# Altium project DisplayBoard.PrjPcb
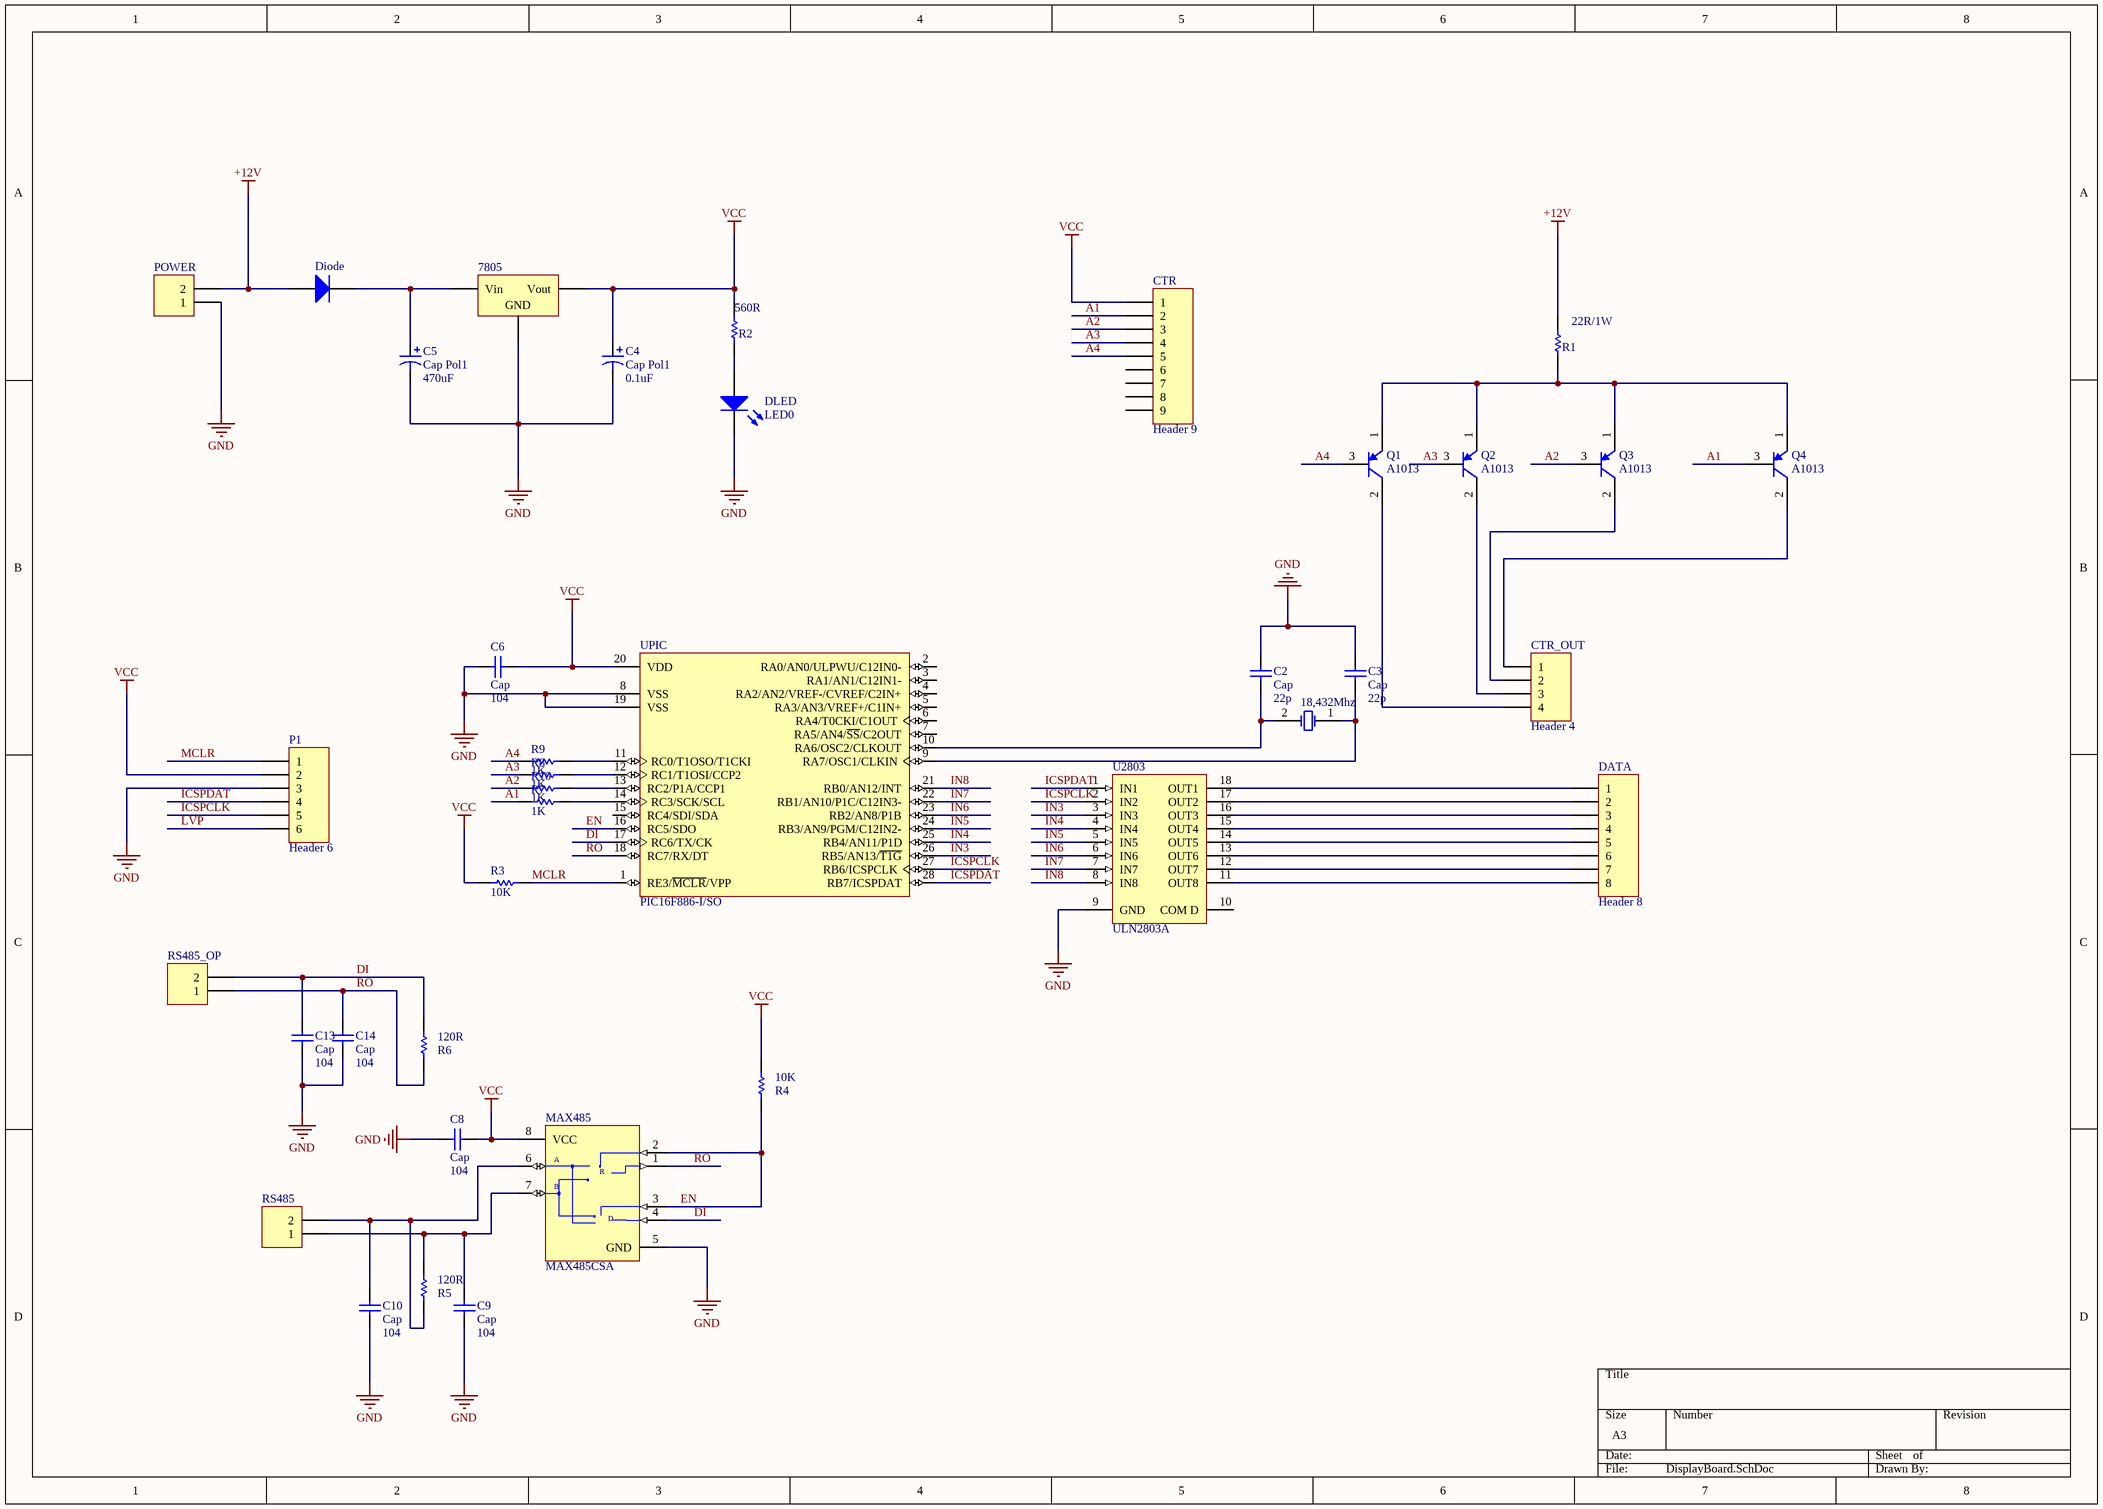
[diagram p0: DisplayBoard.SchDoc]
1 sheet, 38 parts. Net scope: global (net labels, ports and power ports of the same name join across sheets).
Board file: DisplayBoard.PcbDoc

## Sheet DisplayBoard.SchDoc
size A3

### Parts
18,432Mhz  XTAL  [Xtal12M]  (value not drawn)
7805  Volt Reg  [78xx_NO]  (value not drawn)
C2  Cap  value 22p  [tu_gom]
C3  Cap  value 22p  [tu_gom]
C4  Cap Pol1  value 0.1uF  [tu 100uF/50v]
C5  Cap Pol1  value 470uF  [TU 470uF/50V]
C6  Cap  value 104  [tu_gom]
C8  Cap  value 104  [tu_gom]
C9  Cap  value 104  [tu_gom]
C10  Cap  value 104  [tu_gom]
C13  Cap  value 104  [tu_gom]
C14  Cap  value 104  [tu_gom]
CTR  Header 9  [HDR1X9]
CTR_OUT  Header 4  [CAP 4]
DATA  Header 8  [Cap_8]
Diode  Diode  [D_2A]  (value not drawn)
DLED  LED0  [LED_3]
MAX485  MAX485CSA  [NSO8_N]
P1  Header 6  [HDR1X6]
POWER  Header 2  [Header2 - duplicate]  (value not drawn)
Q1  A1013  [A1013]
Q2  A1013  [A1013]
Q3  A1013  [A1013]
Q4  A1013  [A1013]
R1  22R/1W  [R_CS220/470/1W]
R2  560R  [R_Nor]
R3  10K  [R_Nor]
R4  10K  [R_Nor]
R5  120R  [R_Nor]
R6  120R  [R_Nor]
R7  1K  [R_Nor]
R8  1K  [R_Nor]
R9  1K  [R_Nor]
R10  1K  [R_Nor]
RS485  Header 2  [Header2 - duplicate]  (value not drawn)
RS485_OP  Header 2  [Header2 - duplicate]  (value not drawn)
U2803  ULN2803A  [DIP18]
UPIC  PIC16F886-I/SO  [SOIC-SO28_L]

### Nets
+12V: Diode.1(A) POWER.2 R1.2
GND: 7805.2(GND) C2.2 C3.2 C4.2 C5.2 C6.2 C8.1 C9.1 C10.1 C13.1 C14.1 DLED.2(K) MAX485.5(GND) P1.3 POWER.1 U2803.9(GND) UPIC.8(VSS) UPIC.19(VSS)
VCC: 7805.3(Vout) C4.1 C6.1 C8.2 CTR.1 MAX485.8(VCC) P1.2 R2.2 R3.2 R4.2 UPIC.20(VDD)
A1: CTR.2 Q4.3(B) R7.2
A2: CTR.3 Q3.3(B) R10.2
A3: CTR.4 Q2.3(B) R8.2
A4: CTR.5 Q1.3(B) R9.2
DI: C13.2 MAX485.4(DI) R6.2 RS485_OP.2 UPIC.17(RC6/TX/CK)
EN: MAX485.2(~{RE}) MAX485.3(DE) R4.1 UPIC.16(RC5/SDO)
ICSPCLK: P1.5 U2803.2(IN2) UPIC.27(RB6/ICSPCLK)
ICSPDAT: P1.4 U2803.1(IN1) UPIC.28(RB7/ICSPDAT)
IN3: U2803.3(IN3) UPIC.26(RB5/AN13/~{T1G})
IN4: U2803.4(IN4) UPIC.25(RB4/AN11/P1D)
IN5: U2803.5(IN5) UPIC.24(RB3/AN9/PGM/C12IN2-)
IN6: U2803.6(IN6) UPIC.23(RB2/AN8/P1B)
IN7: U2803.7(IN7) UPIC.22(RB1/AN10/P1C/C12IN3-)
IN8: U2803.8(IN8) UPIC.21(RB0/AN12/INT)
LVP: P1.6
MCLR: P1.1 R3.1 UPIC.1(RE3/~{MCLR}/VPP)
RO: C14.2 MAX485.1(RO) R6.1 RS485_OP.1 UPIC.18(RC7/RX/DT)
Net18,432Mhz_1: 18,432Mhz.1(OSC1) C3.1 UPIC.9(RA7/OSC1/CLKIN)
Net18,432Mhz_2: 18,432Mhz.2(OSC2) C2.1 UPIC.10(RA6/OSC2/CLKOUT)
Net7805_1: 7805.1(Vin) C5.1 Diode.2(K)
NetC9_2: C9.2 MAX485.7(B) R5.2 RS485.1
NetC10_2: C10.2 MAX485.6(A) R5.1 RS485.2
NetCTR_OUT_1: CTR_OUT.1 Q4.2(C)
NetCTR_OUT_2: CTR_OUT.2 Q3.2(C)
NetCTR_OUT_3: CTR_OUT.3 Q2.2(C)
NetCTR_OUT_4: CTR_OUT.4 Q1.2(C)
NetDATA_1: DATA.1 U2803.18(OUT1)
NetDATA_2: DATA.2 U2803.17(OUT2)
NetDATA_3: DATA.3 U2803.16(OUT3)
NetDATA_4: DATA.4 U2803.15(OUT4)
NetDATA_5: DATA.5 U2803.14(OUT5)
NetDATA_6: DATA.6 U2803.13(OUT6)
NetDATA_7: DATA.7 U2803.12(OUT7)
NetDATA_8: DATA.8 U2803.11(OUT8)
NetDLED_1: DLED.1(A) R2.1
NetQ1_1: Q1.1(E) Q2.1(E) Q3.1(E) Q4.1(E) R1.1
NetR7_1: R7.1 UPIC.14(RC3/SCK/SCL)
NetR8_1: R8.1 UPIC.12(RC1/T1OSI/CCP2)
NetR9_1: R9.1 UPIC.11(RC0/T1OSO/T1CKI)
NetR10_1: R10.1 UPIC.13(RC2/P1A/CCP1)

Not connected (* = marked no-connect by the designer): CTR 6 7 8 9; U2803 10(COM_D); UPIC 2(RA0/AN0/ULPWU/C12IN0-) 3(RA1/AN1/C12IN1-) 4(RA2/AN2/VREF-/CVREF/C2IN+) 5(RA3/AN3/VREF+/C1IN+) 6(RA4/T0CKI/C1OUT) 7(RA5/AN4/~{SS}/C2OUT) 15(RC4/SDI/SDA)

### Notes on the sheet
- (in symbol MAX485CSA) R; D

### Library data of the parts
18,432Mhz = XTAL: Crystal Oscillator; Published: 8-Jun-2000; LatestRevisionDate: 17-Jul-2002; LatestRevisionNote: Re-released for DXP Platform.; PackageReference: R38; Publisher: Altium Limited
7805 = Volt Reg: Voltage Regulator; Published: 24-Mar-1999; LatestRevisionDate: 29-May-2009; LatestRevisionNote: IPC-7351 Footprint Added.; PackageReference: D2PAK; Publisher: Altium Limited; PackageDescription: 3-Pin Transistor Outline Package 2.54 mm Pitch, 15.1 mm Lead Span
C2 C3 C6 C8-C10 C13 C14 = Ceramic: Capcitor
C4 C5 = Cap Pol1: Polarized Capacitor (Radial); Published: 8-Jun-2000; LatestRevisionDate: 17-Jul-2002; LatestRevisionNote: Re-released for DXP Platform.; PackageReference: RB7.6-15; Publisher: Altium Limited
CTR = Header 9: Header, 9-Pin; LatestRevisionDate: 17-Jul-2002; LatestRevisionNote: Re-released for DXP Platform.; Publisher: Altium Limited
CTR_OUT = Header 4: Header, 4-Pin; LatestRevisionDate: 17-Jul-2002; LatestRevisionNote: Re-released for DXP Platform.; Publisher: Altium Limited
DATA = Header 8: Header, 8-Pin; LatestRevisionDate: 17-Jul-2002; LatestRevisionNote: Re-released for DXP Platform.; Publisher: Altium Limited
Diode = Diode: Default Diode; Published: 8-Jun-2000; LatestRevisionDate: 17-Jul-2002; LatestRevisionNote: Re-released for DXP Platform.; PackageVersion: Sep-1996; PackageReference: SMC; Publisher: Altium Limited; Code_JEDEC: DO-214-AB
DLED = LED0: Typical INFRARED GaAs LED; Published: 8-Jun-2000; LatestRevisionDate: 08-Jul-2005; LatestRevisionNote: Mech Layer 1 removed.; PackageReference: LED-0; Publisher: Altium Limited
MAX485 = MAX485CSA: Low-Power, Slew-Rate-Limited RS-485/RS-422 Transceiver; Published: 16-Jan-2001; LatestRevisionDate: 13-Apr-2006; LatestRevisionNote: IPC-7351 Footprint Added.; DatasheetVersion: Feb-1996; PackageReference: NSO8; Publisher: Altium Limited; PackageDescription: 8-Pin Small Outline Integrated Circuit 1.27 mm Pitch; Code_JEDEC: MS-012-AA; Code_IPC: SOIC127P600-8; ComponentLink1Description: Manufacturer Link; ComponentLink1URL: http://www.maxim-ic.com/; ComponentLink2Description: Datasheet; ComponentLink2URL: http://pdfserv.maxim-ic.com/en/ds/MAX1487-MAX491.pdf
P1 = Header 6: Header, 6-Pin; LatestRevisionDate: 17-Jul-2002; LatestRevisionNote: Re-released for DXP Platform.; Publisher: Altium Limited
POWER RS485 RS485_OP = Header 2: Header, 2-Pin; LatestRevisionDate: 17-Jul-2002; LatestRevisionNote: Re-released for DXP Platform.; Publisher: Altium Limited
Q1-Q4 = PNP: PNP Bipolar Transistor; Published: 8-Jun-2000; LatestRevisionDate: 29-May-2009; LatestRevisionNote: IPC-7351 Footprint Added.; PackageVersion: Aug-1999; PackageReference: SOT-23B; Publisher: Altium Limited; PackageDescription: 3-Pin SOT-23 Package 0.95 mm Pitch, 2.4 mm Lead Span
R1-R10 = Res
U2803 = ULN2803A: Eight Darlington Array; Published: 8-Jun-2000; LatestRevisionDate: 06-Jun-2005; LatestRevisionNote: Stylized 3D Model Added.; DatasheetVersion: Sep-1997; PackageReference: DIP18; Publisher: Altium Limited; PackageDescription: DIP; 18 Leads; Row Spacing 7.62 mm; Pitch 2.54 mm; ComponentLink1Description: Manufacturer Link; ComponentLink1URL: http://www.st.com/; ComponentLink2Description: Datasheet; ComponentLink2URL: http://www.st.com/stonline/products/literature/ds/1536/uln2801a.pdf
UPIC = PIC16F886-I/SO: Flash-Based, 8-Bit CMOS Microcontroller with nanoWatt Technology, 8K (x14-Bit words) Program Memory, 624 Bytes Data Memory, 24 I/O pins, 28-Pin SOIC, Standard VDD Range, Industrial Temperature; FirstPublished: 29-Jan-2009; LatestRevisionDate: 02-Dec-2009; LatestRevisionNote: Updated datasheet to version revF, Apr-2009.; DatasheetVersion: revF, Apr-2009; PackageVersion: revBB, Aug-2009; PackageReference: SOIC-SO28; Publisher: Altium Limited; PackageDescription: 28-Lead Plastic Small Outline (SO) - Wide 7.50mm Body [SOIC]; Supplier 1: Digi-Key; Supplier Part Number 1: PIC16F886-I/SO-ND; Supplier 2: Farnell; Supplier Part Number 2: 1439538; Supplier 3: Newark; Supplier Part Number 3: 74K8576; Code_JEDEC: MS-013; ComponentLink1Description: Datasheet; ComponentLink1URL: http://ww1.microchip.com/downloads/en/DeviceDoc/41291F.pdf; ComponentLink2Description: Packaging Specification; ComponentLink2URL: http://www.microchip.com/stellent/groups/techpub_sg/documents/packagingspec/en012702.pdf; ComponentLink3Description: Microchip.com Home; ComponentLink3URL: http://www.microchip.com/